# EasyEDA Pro project ProProject_STM32H7_Ver0.2_2023-08-24.epro

# Schematic Schematic1
Create Date: 2023-07-07; Page Name: P1; Project Name: STM32H7_Ver0.2; Schematic Name: Schematic1; Update Date: 2023-07-14; Company: 嘉立创EDA; Page Size: A4; Version: V1.0
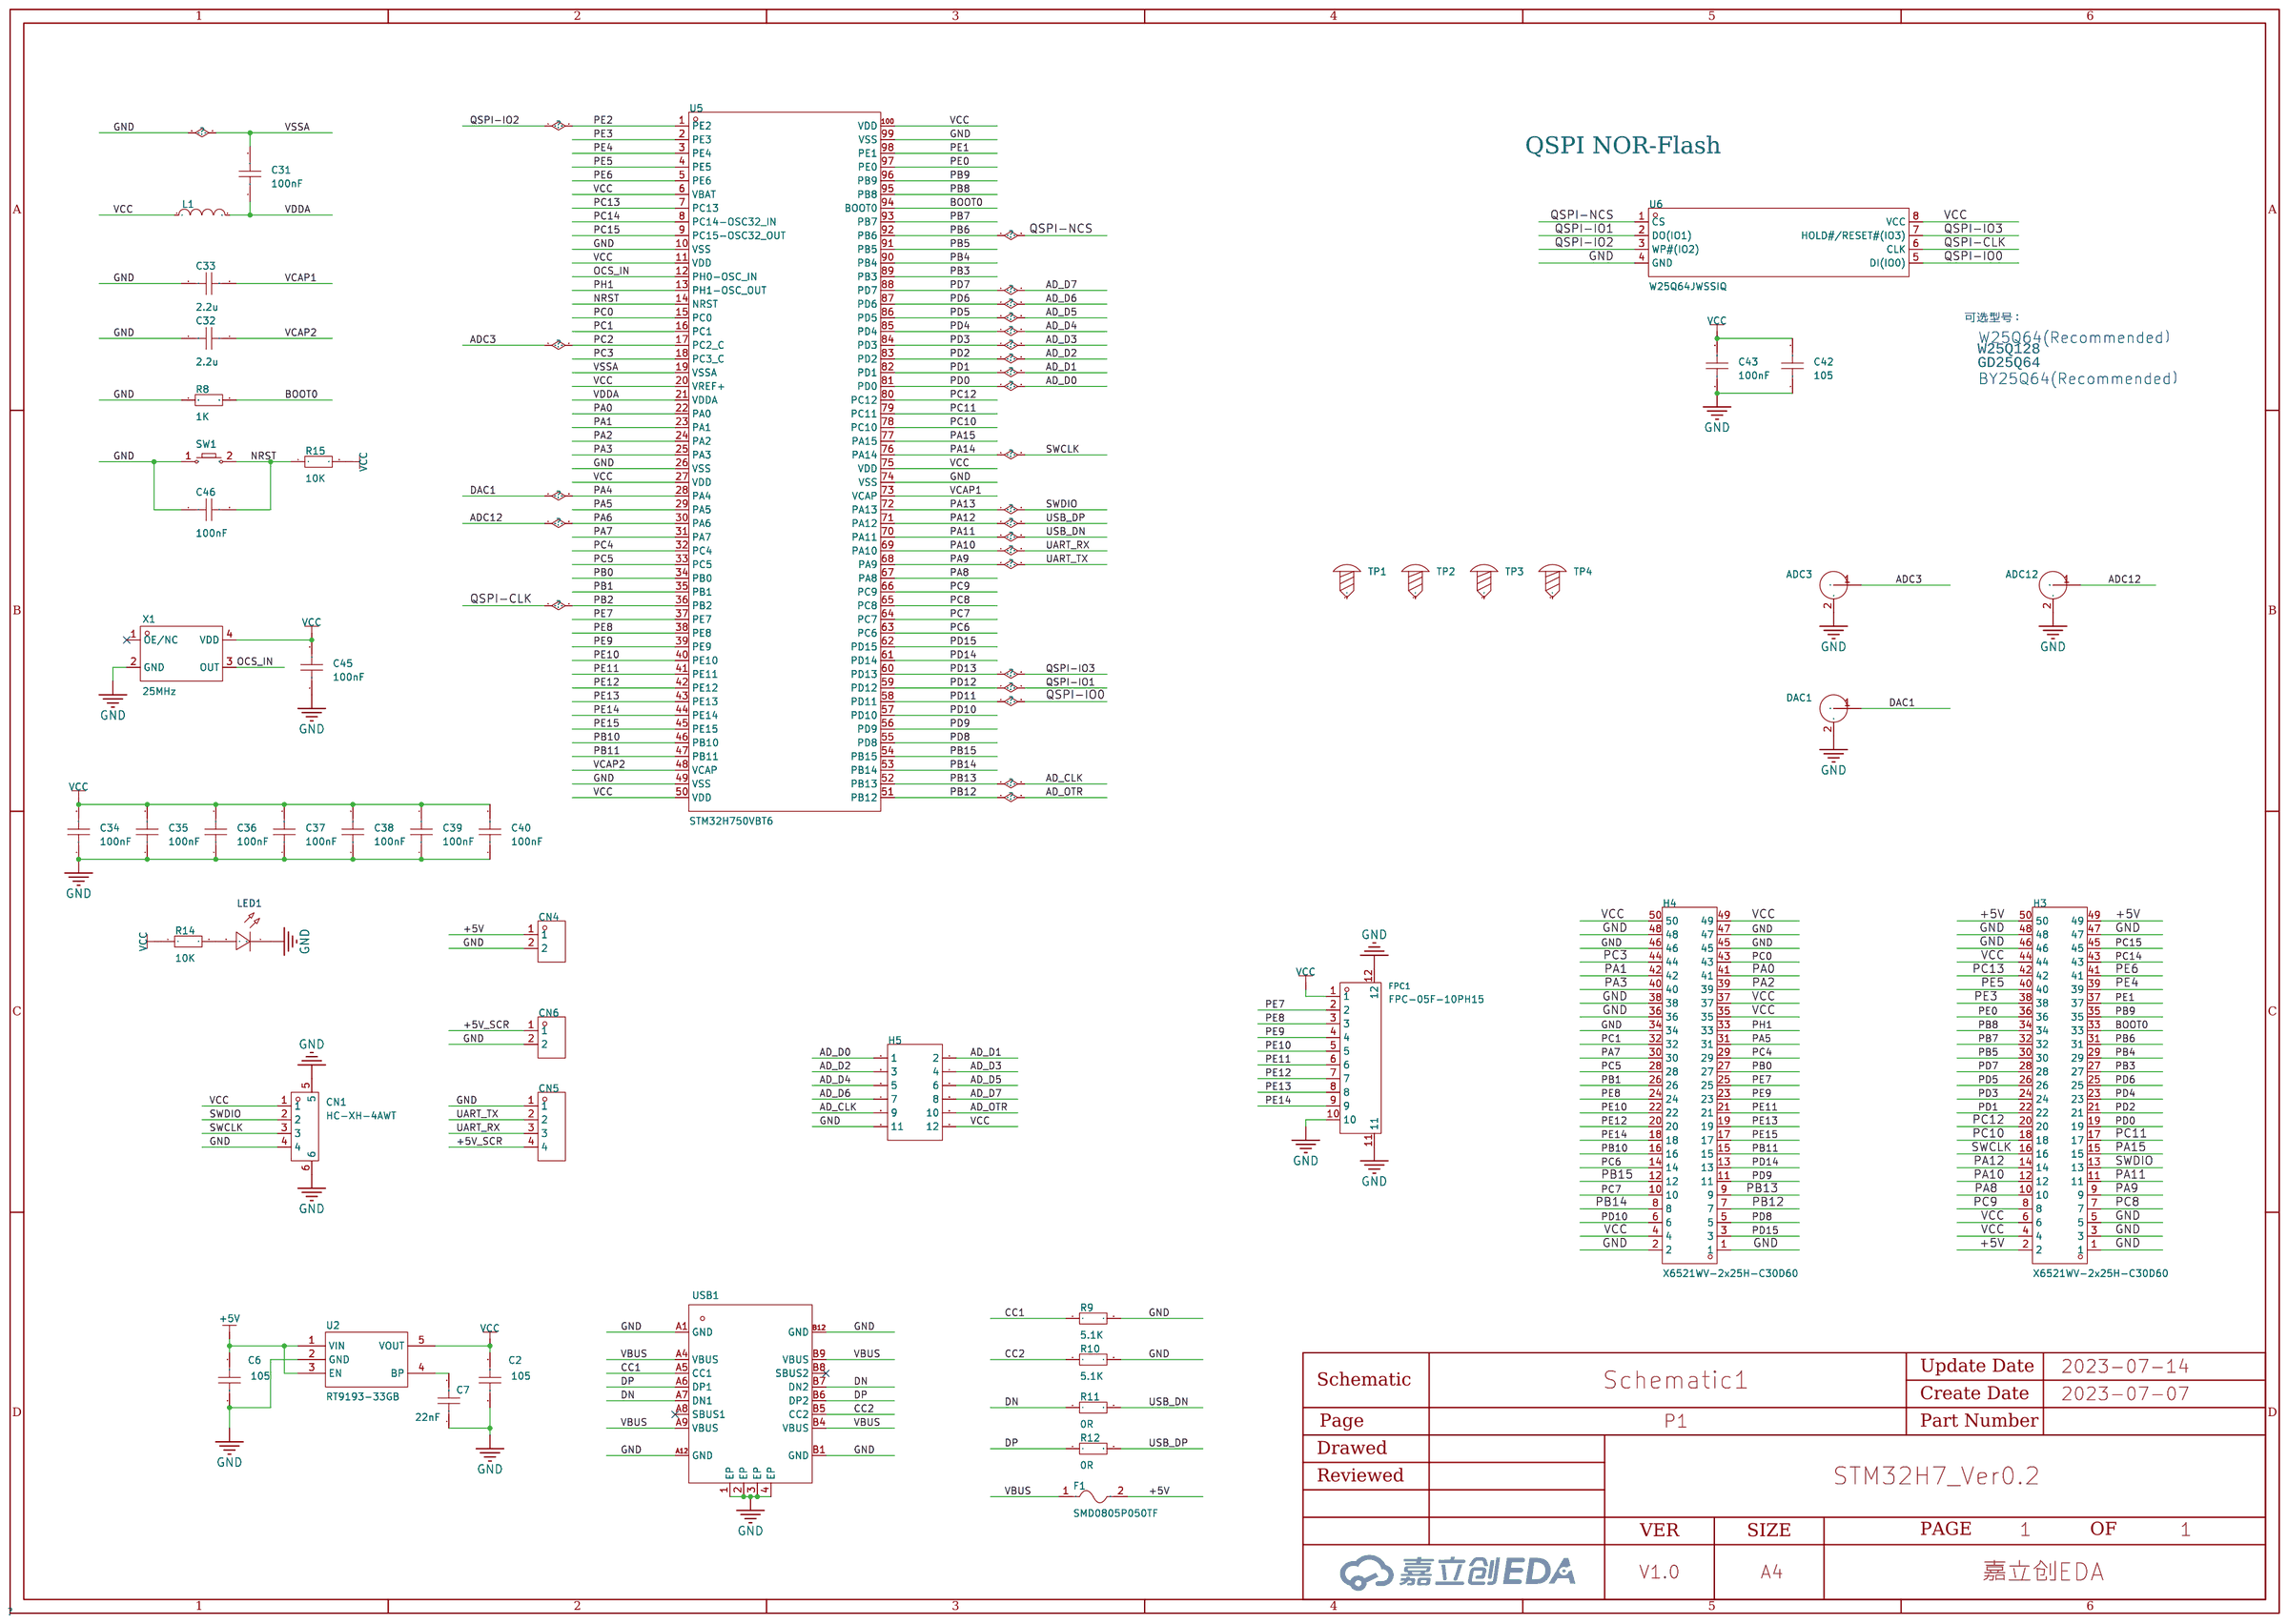
[diagram p0: schematic sheet]

## Parts
ADC3  BWSMA-KWE-Z001  [SMA-TH_BWSMA-KWE-Z001]
ADC12  BWSMA-KWE-Z001  [SMA-TH_BWSMA-KWE-Z001]
C2  100nF  [C0603]
C6  100nF  [C0603]
C7  100nF  [C0603]
C31  100nF  [C0402]
C32  2.2u  [C0603]
C33  2.2u  [C0603]
C34  100nF  [C0402]
C35  100nF  [C0402]
C36  100nF  [C0402]
C37  100nF  [C0402]
C38  100nF  [C0402]
C39  100nF  [C0402]
C40  100nF  [C0402]
C42  105  [C0603]
C43  100nF  [C0603]
C45  100nF  [C0402]
C46  100nF  [C0402]
CN1  HC-XH-4AWT  [CONN-SMD_HC-XH-4AWT]
CN4  HX25003-2A  [CONN-TH_2P-P2.50_HX25003-2A]
CN5  HX25003-4A  [CONN-TH_4P-P2.50_HX25003-4A]
CN6  HX25003-2A  [CONN-TH_2P-P2.50_HX25003-2A]
DAC1  BWSMA-KWE-Z001  [SMA-TH_BWSMA-KWE-Z001]
F1  SMD0805P050TF  [F0805]
FPC1  FPC-05F-10PH15  [FPC-SMD_10P-P0.50_XUNPU_FPC-05F-10PH15]
H3  X6521WV-2x25H-C30D60  [HDR-TH_50P-2.54-V-M-R2-C25-S2.54]
H4  X6521WV-2x25H-C30D60  [HDR-TH_50P-2.54-V-M-R2-C25-S2.54]
H5  -  [HDR-TH_12P-P2.54-V-M-R2-C6-S2.54]
L1  SBH2012S601NSP  [L0805]
LED1  -  [LED_0805]
R8  1K  [R0603]
R9  5.1K  [R0603]
R10  5.1K  [R0603]
R11  0R  [R0603]
R12  0R  [R0603]
R14  10K  [R0603]
R15  10K  [R0603]
SW1  -  [Key_SMD_3x4x2]
TP1  -  [M3螺丝]
TP2  -  [M3螺丝]
TP3  -  [M3螺丝]
TP4  -  [M3螺丝]
U2  RT9193-33GB  [SOT-23-5_L3.0-W1.7-P0.95-LS2.8-BR]
U5  STM32H750VBT6  [LQFP-100_L14.0-W14.0-P0.50-LS16.0-BL]
U6  W25Q64JWSSIQ  [SOIC-8_L5.3-W5.3-P1.27-LS8.0-BL]
USB1  -  [USB_TYPE-C-16P]
X1  25MHz  [OSC-SMD_4P-L3.2-W2.5-BL]

## Library data of the parts
ADC3 ADC12 DAC1 = BWSMA-KWE-Z001: 连接器类型:板端;射频系列:SMA;接口类型:内孔;端口数量:1;阻抗:50Ω;频率-最大值:12.4GHz;样式:弯头;接口直径:5.3mm;接口长度/高度:-;工作温度范围:-;; LCSC Part Name: SMA内孔弯头SMA天线座SMA弯头正脚板端座子; Supplier Part: C496551; Manufacturer: BATWIRELESS(蝙蝠无线); Supplier Footprint: 插件; JLCPCB Part Class: ExtendedPart; Datasheet: https://atta.szlcsc.com/upload/public/pdf/source/20201015/C496551_6AE7B02D24D60B4F78A8937E4C4F8093.pdf; Supplier: LCSC; Connector Type: 板端; RF Series: SMA; Interface Type: 内孔; Number of Ports: 1; Impedance: 50Ω; Frequency-Max: 12.4GHz; Style: 弯头; Interface Diameter: 5.3mm
C2 C6 C7 C32 C33 C42 C43 = CAP_0603: Supplier Footprint: 0603
C31 C34-C40 C45 C46 = CAP_0402: Supplier Footprint: 0402
CN1 = HC-XH-4AWT: 参考系列:-;间距:2.5mm;插针结构:1x4P;排数:1;每排PIN数:4;行距:-;公母:公型插针;安装方式:卧贴;额定电流:3A;工作温度范围:-25℃~+85℃;; LCSC Part Name: 4P卧贴间距P=2.5mm; Supplier Part: C2845685; Manufacturer: HCTL(华灿天禄); Supplier Footprint: SMD,P=2.5mm; JLCPCB Part Class: ExtendedPart; Datasheet: https://atta.szlcsc.com/upload/public/pdf/source/20210728/C2845684_965343274C5A1ED3FF00B3B6BCC0A9E5.pdf; Supplier: LCSC; Pitch: 2.5mm; Pins Structure: 1x4P; Number of Rows: 1; Number of PINs Per Row: 4; Gender: 公型插针; Mounting Style: 卧贴; Current Rating (Max): 3A; Operating Temperature Range: -25℃~+85℃
CN4 CN6 = HX25003-2A: 参考系列:XH;间距:2.5mm;插针结构:1x2P;排数:1;每排PIN数:2;行距:-;公母:公型插针;安装方式:直插;额定电流:-;工作温度范围:-;; LCSC Part Name: XH2.5mm1x2P直插母座; Supplier Part: C442299; Manufacturer: HX(红星); Supplier Footprint: 插件,P=2.5mm; JLCPCB Part Class: ExtendedPart; Datasheet: https://atta.szlcsc.com/upload/public/pdf/source/20191028/C442299_791AF061D32404B3CF2743C2F942DF66.pdf; Supplier: LCSC; Reference Series: XH; Pitch: 2.5mm; Pins Structure: 1x2P; Number of Rows: 1; Number of PINs Per Row: 2; Gender: 公型插针; Mounting Style: 直插
CN5 = HX25003-4A: 参考系列:XH;间距:2.5mm;插针结构:1x4P;排数:1;每排PIN数:4;行距:-;公母:公型插针;安装方式:直插;额定电流:-;工作温度范围:-;; LCSC Part Name: XH2.5mm1x4P直插; Supplier Part: C442301; Manufacturer: HX(红星); Supplier Footprint: 插件,P=2.5mm; JLCPCB Part Class: ExtendedPart; Datasheet: https://atta.szlcsc.com/upload/public/pdf/source/20191028/C442301_3A3D3A554E5F0CBC5D03B496CD495BC6.pdf; Supplier: LCSC; Reference Series: XH; Pitch: 2.5mm; Pins Structure: 1x4P; Number of Rows: 1; Number of PINs Per Row: 4; Gender: 公型插针; Mounting Style: 直插
F1 = SMD0805P050TF_C130286: 最大电压:6V;跳闸电流:1A;; LCSC Part Name: 0.5A6V自恢复保险丝; Supplier Part: C130286; Supplier Footprint: 0805; JLCPCB Part Class: ExtendedPart; Datasheet: https://atta.szlcsc.com/upload/public/pdf/source/20190513/C130286_321817637DA104FC2E38BDC6A20718F4.pdf; Supplier: LCSC
FPC1 = FPC-05F-10PH15: 间距:0.5mm;触点数量:10P;锁定特性:翻盖式;安装类型:卧贴;触点类型:下接;工作温度范围:-25℃~+85℃;; LCSC Part Name: 0.5mm P数:10P 翻盖式 下接; Supplier Part: C2856816; Manufacturer: XUNPU(讯普); Supplier Footprint: SMD,P=0.5mm; JLCPCB Part Class: Extended Part; Datasheet: https://atta.szlcsc.com/upload/public/pdf/source/20210922/C2856816_615E5C188F8387E0CDE660452299C2FD.pdf; Supplier: LCSC; Pitch: 0.5mm; Number of Contacts: 10P; Locking Feature: 翻盖式; Mounting Type: 卧贴; Contact Type: 下接; Height Above Board: 1.5mm; FFC, FCB Thickness: 0.3mm; Operating Temperature Range: -25℃~+85℃
H3 H4 = X6521WV-2x25H-C30D60: 排数:双排;总PIN位数:50;间距:2.54mm;插针结构:2x25P;行距:2.54mm;安装类型:直插;圆针/方针:方针;额定电流:3A;额定电压:250V;配合针长度:6mm;塑高:2.5mm;端接针长度:3mm;触头材质:黄铜;触头镀层:金;工作温度范围:-40℃~+105℃;焊接温度(最大值):260℃;颜色:黑色;; LCSC Part Name: 2.54mm2x25P直插方针; Supplier Part: C725897; Manufacturer: XKBConnectivity(中国星坤); Supplier Footprint: 插件,P=2.54mm; JLCPCB Part Class: ExtendedPart; Datasheet: https://atta.szlcsc.com/upload/public/pdf/source/20211009/DE33EBA4104B5B447A7BD8383FBBA145.pdf; Supplier: LCSC; Number of Rows: 双排; Number of Pins: 50; Pitch: 2.54mm; Pin Structure: 2x25P; Row Spacing: 2.54mm; Mounting Type: 直插; Circluar Pins/Square Pins: 方针; Current Rating (Max): 3A; Voltage Rating (Max): 250V; Length of Mating Pin: 6mm; Insulation Height: 2.5mm; Length of End Connection Pin: 3mm; Contact Material: 黄铜; Contact Plating: 金; Operating Temperature Range: -40℃~+105℃; Welding Temperature (Max): 260℃; Color: 黑色
H5 = HDR-F_2.54_2x6: Supplier Part: C92270; Supplier Footprint: 插件
L1 = SBH2012S601NSP: 标称阻抗@测试频率:600Ω@100MHz;误差:±25%;直流电阻(RDC):90mΩ;额定电流:2A;电路数:1;; LCSC Part Name: 600Ω@100MHz±25%; Supplier Part: f; Manufacturer: Sunltech(韩国顺磁); Supplier Footprint: SMD; JLCPCB Part Class: ExtendedPart; Datasheet: https://atta.szlcsc.com/upload/public/pdf/source/20180502/C216152_A4DD12EF526EA5B19012580C3D24E2AB.pdf; Supplier: LCSC; Impedance @ Frequency: 600Ω@100MHz; Tolerance: ±25%; DC Resistance: 90mΩ; Current Rating: 2A; Circuits: 1
LED1 = LED_0805-G: Supplier Footprint: 0805
R8-R12 R14 R15 = Res_0603: Supplier Footprint: 0603
SW1 = Key_SMD_3x4x2: Supplier Footprint: SMD
TP1-TP4 = M3螺丝: Supplier Footprint: 插件
U2 = RT9193-18GB: 输出类型:固定;输出极性:正;输出通道数:1;最大输入电压:5.5V;输出电压:1.8V~1.8V;压差:-;输出电流:300mA;电源纹波抑制比(PRSS):70dB@(100Hz),50dB@(10kHz);; LCSC Part Name: Vin=5.5VVout=1.8V~1.8V300mA70dB@(100Hz),50dB@(10kHz); Supplier Part: C27416; Manufacturer: RICHTEK(台湾立锜); Supplier Footprint: SOT-23-5; JLCPCB Part Class: ExtendedPart; Datasheet: https://atta.szlcsc.com/upload/public/pdf/source/20140319/1457707024880.pdf; Supplier: LCSC; Output Type: 固定; Output Polarity: 正; Number of Outputs: 1; Maximum Input Voltage: 5.5V; Output Voltage: 1.8V~1.8V; Output Current: 300mA; Power Supply Rejection Ratio (PRSS): 70dB@(100Hz),50dB@(10kHz)
U5 = STM32H750VBT6: CPU内核:ARM-M系列;CPU最大主频:480MHz;程序存储容量:128KB;程序存储器类型:FLASH;RAM总容量:1MB;GPIO端口数量:82;; LCSC Part Name: ARM-M系列480MHz; Supplier Part: C404010; Manufacturer: ST(意法半导体); Supplier Footprint: LQFP-100(14x14); JLCPCB Part Class: ExtendedPart; Datasheet: https://atta.szlcsc.com/upload/public/pdf/source/20190722/C404010_6028FDD7E25CA1D71DA8F4066CF0EFF7.pdf; Supplier: LCSC; CPU Core: ARM-M系列; CPU Maximum Speed: 480MHz; Operating Voltage Range: 1.62V~3.6V; Program Storage Size: 128KB; Program Memory Type: FLASH; RAM Size: 1MB; EEPROM: 128KB; GPIO Ports Number: 82; ADC (Bit): 16bit; DAC (Bit): 12bit; Universal Serial Bus: 有; Peripheral/Function: DMA；LCD/LED驱动; Watchdog: 有; Infrared Data Association: 有; Low-Voltage Detect: 有; LCD Module: 有; Secure Digital Input and Output: 有; Direct Memory Access: 有; Internal Oscillator: 有; Operating Temperature Range: -40℃~+85℃
U6 = W25Q64JWSSIQ_C2895586: Supplier Part: C2895586; Manufacturer: WINBOND(华邦); Supplier Footprint: SOIC-8-208mil; JLCPCB Part Class: ExtendedPart; Datasheet: https://atta.szlcsc.com/upload/public/pdf/source/20210420/C2595075_E7A7725B7CF2DE50C07916BF10CAF3A1.pdf; Supplier: LCSC
USB1 = USB_TYPE-C-16P: Supplier Footprint: SMD
X1 = CO32H4-25.000-33JDTSN: 频率:25MHz;频率稳定度:±30ppm;工作电压:3.3V;输出模式:HCMOS;工作温度:-40~+85;; LCSC Part Name: 25MHz±30ppm3.3VHCMOS; Supplier Part: C2925590; Manufacturer: HCI(杭晶); Supplier Footprint: SMD3225-4P; JLCPCB Part Class: ExtendedPart; Datasheet: https://atta.szlcsc.com/upload/public/pdf/source/20220525/B926948FC129C170F991EA6FAC6092C6.pdf; Supplier: LCSC; Frequency Stability: ±30ppm; Supply Voltage: 3.3V; Output Type: HCMOS; Operating Temperature: -40~+85

## Nets
+5V: C6.2 CN4.1 F1.2 H3.2 H3.49 H3.50 U2.1(VIN) U2.3(EN)
+5V_SCR: CN5.4 CN6.1
GND: ADC3.2 ADC12.2 C2.1 C6.1 C7.1 C31.2 C32.2 C33.2 C34.1 C35.1 C36.1 C37.1 C38.1 C39.1 C40.1 C42.1 C43.1 C45.1 C46.1 CN1.4 CN1.5 CN1.6 CN4.2 CN5.1 CN6.2 DAC1.2 FPC1.10 FPC1.11 FPC1.12 H3.1 H3.3 H3.5 H3.46 H3.47 H3.48 H4.1 H4.2 H4.34 H4.36 H4.38 H4.45 H4.46 H4.47 H4.48 H5.11 LED1.1(C) R8.1 R9.2 R10.2 SW1.1 U2.2(GND) U5.10(VSS) U5.19(VSSA) U5.26(VSS) U5.49(VSS) U5.74(VSS) U5.99(VSS) U6.4(GND) USB1.1(EP) USB1.2(EP) USB1.3(EP) USB1.4(EP) USB1.A1(GND) USB1.A12(GND) USB1.B1(GND) USB1.B12(GND) X1.2(GND)
VBUS: F1.1 USB1.A4(VBUS) USB1.A9(VBUS) USB1.B4(VBUS) USB1.B9(VBUS)
VCC: C2.2 C34.2 C35.2 C36.2 C37.2 C38.2 C39.2 C40.2 C42.2 C43.2 C45.2 CN1.1 FPC1.1 H3.4 H3.6 H3.44 H4.4 H4.35 H4.37 H4.49 H4.50 H5.12 L1.1 R14.1 R15.2 U2.5(VOUT) U5.6(VBAT) U5.11(VDD) U5.20(VREF+) U5.27(VDD) U5.50(VDD) U5.75(VDD) U5.100(VDD) U6.8(VCC) X1.4(VDD)
VDDA: C31.1 L1.2 U5.21(VDDA)
AD_CLK: H4.9 H5.9 U5.52(PB13)
AD_D0: H3.19 H5.1 U5.81(PD0)
AD_D1: H3.22 H5.2 U5.82(PD1)
AD_D2: H3.21 H5.3 U5.83(PD2)
AD_D3: H3.24 H5.4 U5.84(PD3)
AD_D4: H3.23 H5.5 U5.85(PD4)
AD_D5: H3.26 H5.6 U5.86(PD5)
AD_D6: H3.25 H5.7 U5.87(PD6)
AD_D7: H3.28 H5.8 U5.88(PD7)
AD_OTR: H4.7 H5.10 U5.51(PB12)
ADC3: ADC3.1 U5.17(PC2_C)
ADC12: ADC12.1 U5.30(PA6)
BOOT0: H3.33 R8.2 U5.94(BOOT0)
CC1: R9.1 USB1.A5(CC1)
CC2: R10.1 USB1.B5(CC2)
DAC1: DAC1.1 U5.28(PA4)
DN: R11.1 USB1.A7(DN1) USB1.B7(DN2)
DP: R12.1 USB1.A6(DP1) USB1.B6(DP2)
NRST: C46.2 R15.1 SW1.2 U5.14(NRST)
OCS_IN: U5.12(PH0-OSC_IN) X1.3(OUT)
PA0: H4.41 U5.22(PA0)
PA1: H4.42 U5.23(PA1)
PA2: H4.39 U5.24(PA2)
PA3: H4.40 U5.25(PA3)
PA5: H4.31 U5.29(PA5)
PA7: H4.30 U5.31(PA7)
PA8: H3.10 U5.67(PA8)
PA9: CN5.2 H3.9 U5.68(PA9)
PA10: CN5.3 H3.12 U5.69(PA10)
PA11: H3.11 R11.2 U5.70(PA11)
PA12: H3.14 R12.2 U5.71(PA12)
PA13: CN1.2 H3.13 U5.72(PA13)
PA14: CN1.3 H3.16 U5.76(PA14)
PA15: H3.15 U5.77(PA15)
PB0: H4.27 U5.34(PB0)
PB1: H4.26 U5.35(PB1)
PB2: U5.36(PB2) U6.6(CLK)
PB3: H3.27 U5.89(PB3)
PB4: H3.29 U5.90(PB4)
PB5: H3.30 U5.91(PB5)
PB6: H3.31 U5.92(PB6) U6.1(CS)
PB7: H3.32 U5.93(PB7)
PB8: H3.34 U5.95(PB8)
PB9: H3.35 U5.96(PB9)
PB10: H4.16 U5.46(PB10)
PB11: H4.15 U5.47(PB11)
PB14: H4.8 U5.53(PB14)
PB15: H4.12 U5.54(PB15)
PC0: H4.43 U5.15(PC0)
PC1: H4.32 U5.16(PC1)
PC3: H4.44 U5.18(PC3_C)
PC4: H4.29 U5.32(PC4)
PC5: H4.28 U5.33(PC5)
PC6: H4.14 U5.63(PC6)
PC7: H4.10 U5.64(PC7)
PC8: H3.7 U5.65(PC8)
PC9: H3.8 U5.66(PC9)
PC10: H3.18 U5.78(PC10)
PC11: H3.17 U5.79(PC11)
PC12: H3.20 U5.80(PC12)
PC13: H3.42 U5.7(PC13)
PC14: H3.43 U5.8(PC14-OSC32_IN)
PC15: H3.45 U5.9(PC15-OSC32_OUT)
PD8: H4.5 U5.55(PD8)
PD9: H4.11 U5.56(PD9)
PD10: H4.6 U5.57(PD10)
PD11: U5.58(PD11) U6.5(DI(IO0))
PD12: U5.59(PD12) U6.2(DO(IO1))
PD13: U5.60(PD13) U6.7(HOLD#/RESET#(IO3))
PD14: H4.13 U5.61(PD14)
PD15: H4.3 U5.62(PD15)
PE0: H3.36 U5.97(PE0)
PE1: H3.37 U5.98(PE1)
PE2: U5.1(PE2) U6.3(WP#(IO2))
PE3: H3.38 U5.2(PE3)
PE4: H3.39 U5.3(PE4)
PE5: H3.40 U5.4(PE5)
PE6: H3.41 U5.5(PE6)
PE7: FPC1.2 H4.25 U5.37(PE7)
PE8: FPC1.3 H4.24 U5.38(PE8)
PE9: FPC1.4 H4.23 U5.39(PE9)
PE10: FPC1.5 H4.22 U5.40(PE10)
PE11: FPC1.6 H4.21 U5.41(PE11)
PE12: FPC1.7 H4.20 U5.42(PE12)
PE13: FPC1.8 H4.19 U5.43(PE13)
PE14: FPC1.9 H4.18 U5.44(PE14)
PE15: H4.17 U5.45(PE15)
PH1: H4.33 U5.13(PH1-OSC_OUT)
VCAP1: C33.1 U5.73(VCAP)
VCAP2: C32.1 U5.48(VCAP)
$1N6362: C7.2 U2.4(BP)
$1N9146: LED1.2(A) R14.2

Not connected (* = marked no-connect by the designer): TP1 1; TP2 1; TP3 1; TP4 1; USB1 A8(SBUS1)* B8(SBUS2)*; X1 1(OE/NC)*

## Notes on the sheet
- QSPI NOR-Flash
- 可选型号：
- W25Q64(Recommended）
- GD25Q64
- W25Q128
- BY25Q64(Recommended）

# Board PCB1
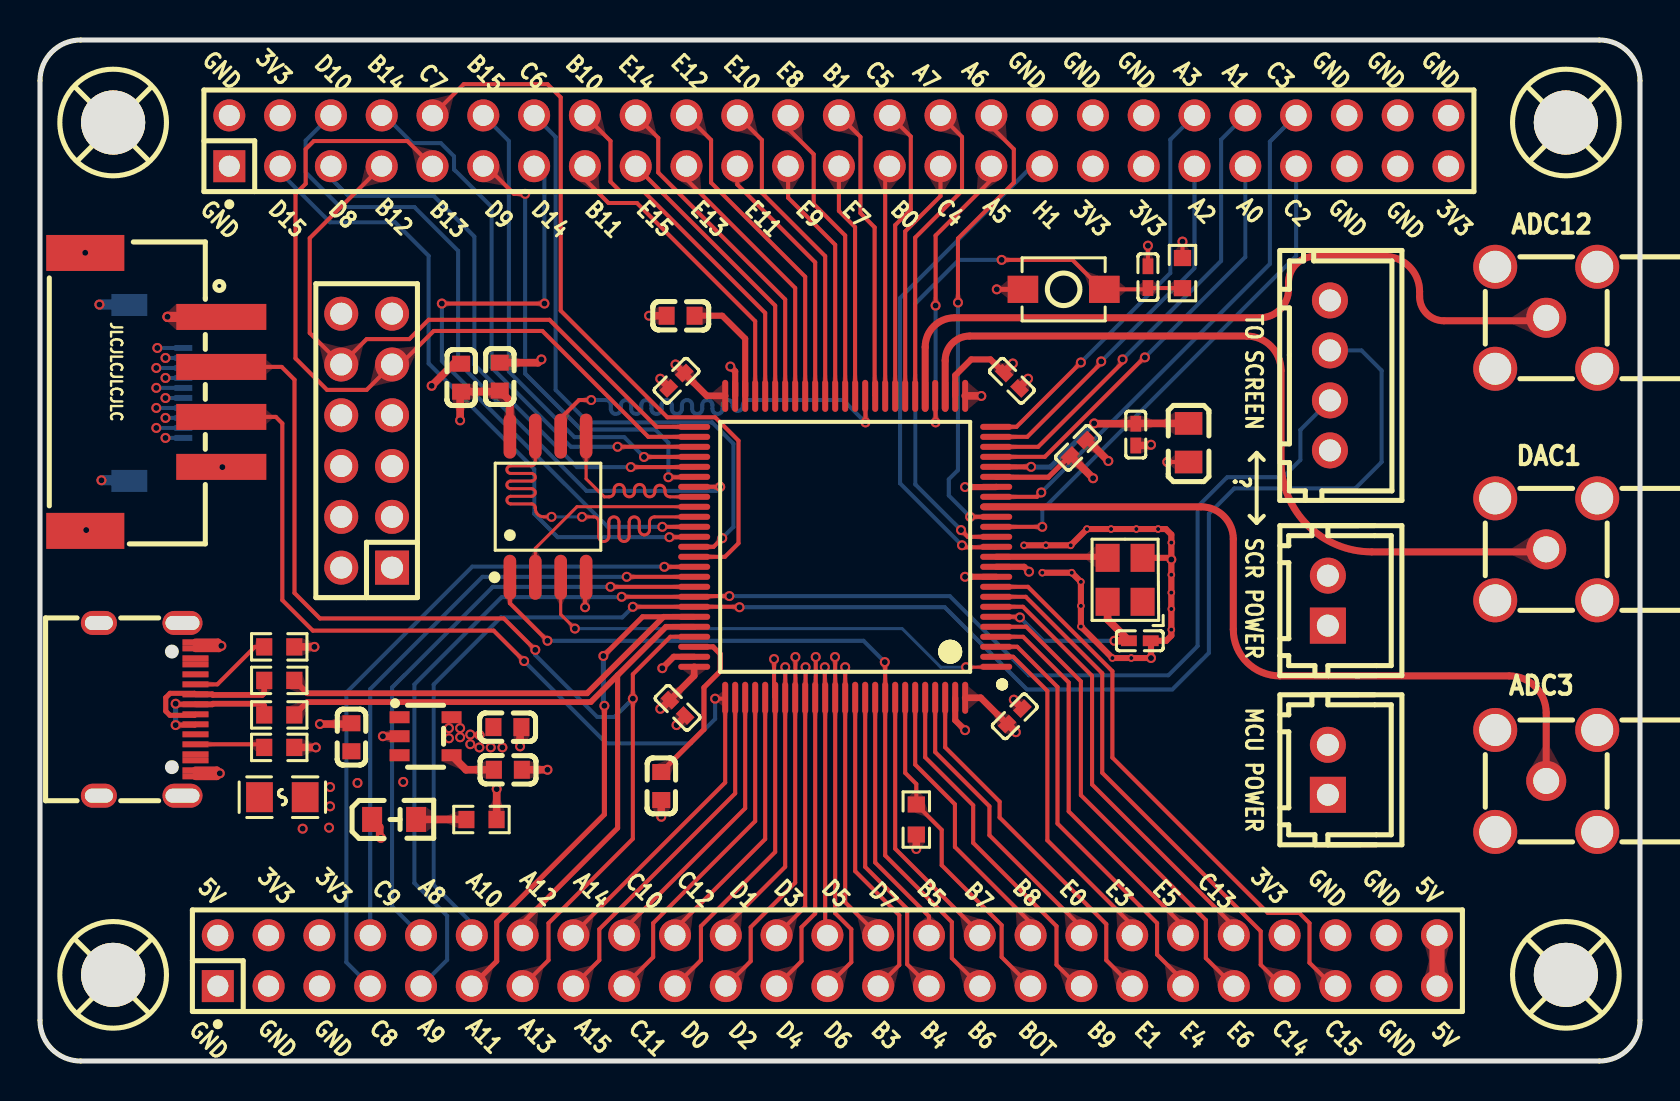
[diagram p1: board, top side]
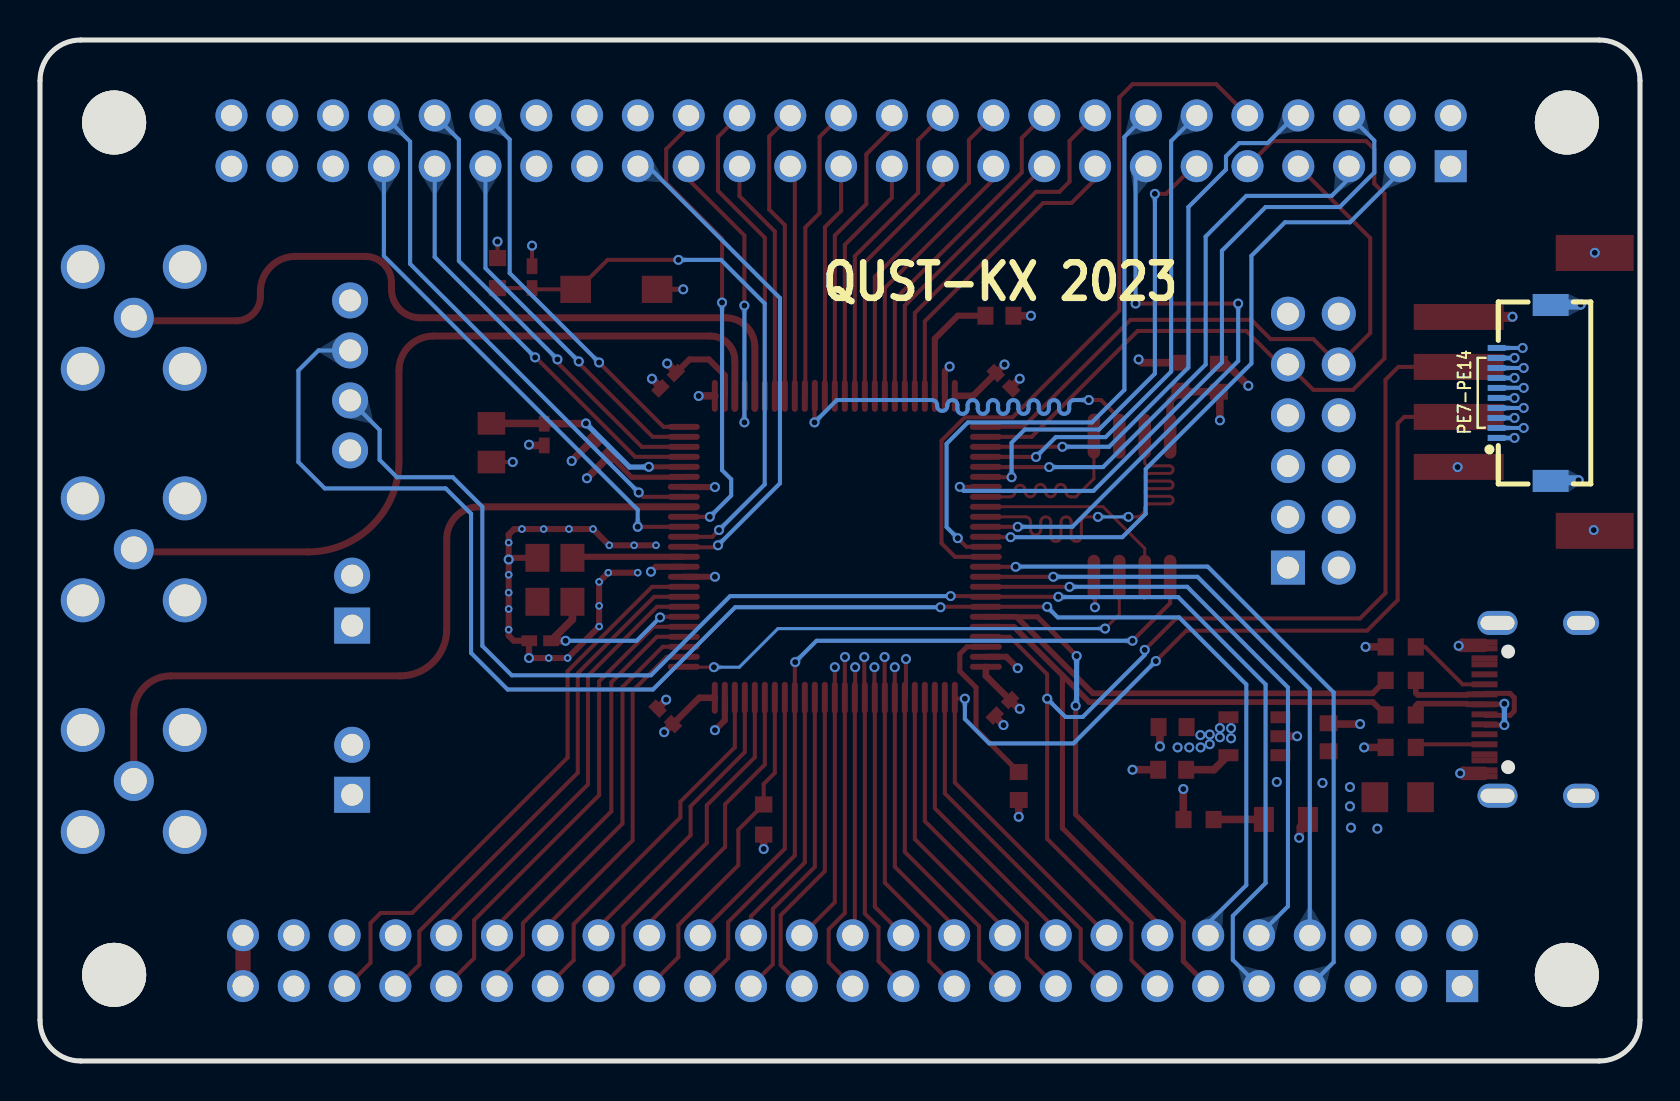
[diagram p2: board, bottom side, seen from below]

Outline 80 x 51.07 mm; copper layers: Top Layer, Inner1, Inner2, Bottom Layer. Coordinates in mm from the lower left corner of the outline.
Outline path: 0,49.03 0,2.03 arc(0.6,0.6) 2.03,0 77.97,0 arc(79.4,0.6) 80,2.03 80,49.03 arc(79.4,50.47) 77.97,51.07 2.03,51.07 arc(0.6,50.47) 0,49.03
Stack: Top Layer 0.035mm / Dielectric1 0.48mm PP er 4.5 / Inner1 0.035mm / Dielectric2 0.48mm FR4 er 4.5 / Inner2 0.035mm / Dielectric3 0.48mm PP er 4.5 / Bottom Layer 0.035mm

## Design rules (mm)
net PA12: DP2
net PA11: DP2
net DN: DP1
net DP: DP1
template: 自定义配置
spacing copperThickness1oz (default): track to track 0.102, other pairs 0.152 to 0.3
spacing copperThickness2oz: track to track 0.203, other pairs 0.152 to 0.3
track width copperThickness1oz (default): min 0.127, default 0.203, max 2.54
track width copperThickness2oz: min 0.203, default 0.254, max 2.54
differential pair differentialPair (default): width min 0.127, default 0.254, max 2.54; gap min 0.152, default 0.152
via viaSize (default): diameter min 0, default 0.381, max 10; hole min 0, default 0.203, max 6.299

## Placement (name value [footprint] x y rotation side)
ADC3  BWSMA-KWE-Z001  [SMA-TH_BWSMA-KWE-Z001]  75.31 14.01 0 top
ADC12  BWSMA-KWE-Z001  [SMA-TH_BWSMA-KWE-Z001]  75.31 37.17 0 top
C2  100nF  [C0603]  23.37 16.7 180 top
C6  100nF  [C0603]  15.57 16.19 270 top
C7  100nF  [C0603]  23.39 14.57 180 top
C31  100nF  [C0402]  54.79 31.33 270 top
C32  2.2u  [C0603]  32.03 37.27 180 top
C33  2.2u  [C0603]  31.06 13.75 270 top
C34  100nF  [C0402]  51.89 30.67 225 top
C37  100nF  [C0402]  31.83 34.02 45 top
C38  100nF  [C0402]  48.74 17.24 225 top
C39  100nF  [C0402]  31.88 17.67 135 top
C40  100nF  [C0402]  48.59 34.02 135 top
C42  105  [C0603]  22.99 34.23 270 top
C43  100nF  [C0603]  21.06 34.18 270 top
C45  100nF  [C0402]  54.99 21.02 180 top
C46  100nF  [C0402]  55.4 39.21 270 top
CN1  HC-XH-4AWT  [CONN-SMD_HC-XH-4AWT]  5.66 33.46 270 top
CN4  HX25003-2A  [CONN-TH_2P-P2.50_HX25003-2A]  64.39 14.57 90 top
CN5  HX25003-4A  [CONN-TH_4P-P2.50_HX25003-4A]  64.5 34.29 90 top
CN6  HX25003-2A  [CONN-TH_2P-P2.50_HX25003-2A]  64.39 23.03 90 top
DAC1  BWSMA-KWE-Z001  [SMA-TH_BWSMA-KWE-Z001]  75.31 25.59 0 top
F1  SMD0805P050TF  [F0805]  12.12 13.2 0 top
FPC1  FPC-05F-10PH15  [FPC-SMD_10P-P0.50_XUNPU_FPC-05F-10PH15]  5.82 33.41 90 bottom
H3  X6521WV-2x25H-C30D60  [HDR-TH_50P-2.54-V-M-R2-C25-S2.54]  39.37 5.02 0 top
H4  X6521WV-2x25H-C30D60  [HDR-TH_50P-2.54-V-M-R2-C25-S2.54]  39.95 46.02 0 top
H5  -  [HDR-TH_12P-P2.54-V-M-R2-C6-S2.54]  16.33 31.03 90 top
L1  SBH2012S601NSP  [L0805]  57.43 30.92 90 top
LED1  -  [LED_0805]  17.75 12.08 0 top
R8  1K  [R0603]  43.82 12.08 90 top
R9  5.1K  [R0603]  11.96 20.71 0 top
R10  5.1K  [R0603]  11.96 15.68 0 top
R11  0R  [R0603]  11.96 19.04 0 top
R12  0R  [R0603]  11.96 17.31 0 top
R14  10K  [R0603]  22.07 12.08 180 top
R15  10K  [R0603]  57.12 39.41 90 top
SW1  -  [Key_SMD_3x4x2]  51.18 38.6 0 top
TP1  -  [M3螺丝]  3.72 4.25 0 top
TP2  -  [M3螺丝]  3.72 46.88 0 top
TP3  -  [M3螺丝]  76.36 46.88 0 top
TP4  -  [M3螺丝]  76.36 4.25 0 top
U2  RT9193-33GB  [SOT-23-5_L3.0-W1.7-P0.95-LS2.8-BR]  19.28 16.24 180 top
U5  STM32H750VBT6  [LQFP-100_L14.0-W14.0-P0.50-LS16.0-BL]  40.26 25.72 90 top
U6  W25Q64JWSSIQ  [SOIC-8_L5.3-W5.3-P1.27-LS8.0-BL]  25.4 27.72 0 top
USB1  -  [USB_TYPE-C-16P]  5.36 17.72 270 top
X1  25MHz  [OSC-SMD_4P-L3.2-W2.5-BL]  54.25 24.07 90 top

## Footprints (pads in the part's own frame, mm; a bottom-side part is the same pattern mirrored in y, then rotated)
C0402
  rect 0.79x0.54 smd: 1(-0.545,0) 2(0.545,0)
C0603
  rect 0.8x0.9 smd: 1(-0.7,0) 2(0.7,0)
CONN-SMD_HC-XH-4AWT
  rect 1.3x4.5 smd: 1(-3.75,3.4) 2(-1.25,3.4) 3(1.25,3.4) 4(3.75,3.4)
  rect 1.8x3.9 smd: 5(-6.95,-3.4) 6(6.95,-3.4)
CONN-TH_2P-P2.50_HX25003-2A
  rect 1.8x1.8 hole 1.1: 1(-1.25,0)
  round 1.8 hole 1.1: 2(1.25,0)
CONN-TH_4P-P2.50_HX25003-4A
  round 1.8 hole 1.1: 1(-3.75,0) 2(-1.25,0) 3(1.25,0) 4(3.75,0)
F0805
  rect 1.335x1.5 smd: 1(-1.143,0) 2(1.143,0)
FPC-SMD_10P-P0.50_XUNPU_FPC-05F-10PH15
  rect 0.3x0.9 smd: 1(-2.25,1.35) 2(-1.75,1.35) 3(-1.25,1.35) 4(-0.75,1.35) 5(-0.25,1.35) 6(0.25,1.35) 7(0.75,1.35) 8(1.25,1.35) 9(1.75,1.35) 10(2.25,1.35)
  rect 1.1x1.8 smd: 11(4.4,-1.35) 12(-4.4,-1.35)
HDR-TH_12P-P2.54-V-M-R2-C6-S2.54
  rect 1.7x1.7 hole 1.1: 1(-6.35,-1.27)
  round 1.7 hole 1.1: 2(-6.35,1.27) 3(-3.81,-1.27) 4(-3.81,1.27) 5(-1.27,-1.27) 6(-1.27,1.27) 7(1.27,-1.27) 8(1.27,1.27) 9(3.81,-1.27) 10(3.81,1.27) 11(6.35,-1.27) 12(6.35,1.27)
HDR-TH_50P-2.54-V-M-R2-C25-S2.54
  rect 1.6x1.6 hole 1.05: 1(-30.48,-1.27)
  round 1.6 hole 1.05: 2(-30.48,1.27) 3(-27.94,-1.27) 4(-27.94,1.27) 5(-25.4,-1.27) 6(-25.4,1.27) 7(-22.86,-1.27) 8(-22.86,1.27) 9(-20.32,-1.27) 10(-20.32,1.27) 11(-17.78,-1.27) 12(-17.78,1.27) 13(-15.24,-1.27) 14(-15.24,1.27) 15(-12.7,-1.27) 16(-12.7,1.27) 17(-10.16,-1.27) 18(-10.16,1.27) 19(-7.62,-1.27) 20(-7.62,1.27) 21(-5.08,-1.27) 22(-5.08,1.27) 23(-2.54,-1.27) 24(-2.54,1.27) 25(0,-1.27) 26(0,1.27) 27(2.54,-1.27) 28(2.54,1.27) 29(5.08,-1.27) 30(5.08,1.27) 31(7.62,-1.27) 32(7.62,1.27) 33(10.16,-1.27) 34(10.16,1.27) 35(12.7,-1.27) 36(12.7,1.27) 37(15.24,-1.27) 38(15.24,1.27) 39(17.78,-1.27) 40(17.78,1.27) 41(20.32,-1.27) 42(20.32,1.27) 43(22.86,-1.27) 44(22.86,1.27) 45(25.4,-1.27) 46(25.4,1.27) 47(27.94,-1.27) 48(27.94,1.27) 49(30.48,-1.27) 50(30.48,1.27)
Key_SMD_3x4x2
  rect 1.53x1.36 smd: 1(-2.035,0) 2(2.035,0)
L0805
  rect 1.133x1.377 smd: 1(-0.966,0) 2(0.966,0)
LED_0805
  rect 1x1.25 smd: 1(-1.15,0.005) 2(1.05,0.005)
LQFP-100_L14.0-W14.0-P0.50-LS16.0-BL
  oval 0.3x1.6 smd: 1(-6,-7.55) 2(-5.5,-7.55) 3(-5,-7.55) 4(-4.5,-7.55) 5(-4,-7.55) 6(-3.5,-7.55) 7(-3,-7.55) 8(-2.5,-7.55) 9(-2,-7.55) 10(-1.5,-7.55) 11(-1,-7.55) 12(-0.5,-7.55) 13(0,-7.55) 14(0.5,-7.55) 15(1,-7.55) 16(1.5,-7.55) 17(2,-7.55) 18(2.5,-7.55) 19(3,-7.55) 20(3.5,-7.55) 21(4,-7.55) 22(4.5,-7.55) 23(5,-7.55) 24(5.5,-7.55) 25(6,-7.55) 51(6,7.55) 52(5.5,7.55) 53(5,7.55) 54(4.5,7.55) 55(4,7.55) 56(3.5,7.55) 57(3,7.55) 58(2.5,7.55) 59(2,7.55) 60(1.5,7.55) 61(1,7.55) 62(0.5,7.55) 63(0,7.55) 64(-0.5,7.55) 65(-1,7.55) 66(-1.5,7.55) 67(-2,7.55) 68(-2.5,7.55) 69(-3,7.55) 70(-3.5,7.55) 71(-4,7.55) 72(-4.5,7.55) 73(-5,7.55) 74(-5.5,7.55) 75(-6,7.55)
  oval 1.6x0.3 smd: 26(7.55,-6) 27(7.55,-5.5) 28(7.55,-5) 29(7.55,-4.5) 30(7.55,-4) 31(7.55,-3.5) 32(7.55,-3) 33(7.55,-2.5) 34(7.55,-2) 35(7.55,-1.5) 36(7.55,-1) 37(7.55,-0.5) 38(7.55,0) 39(7.55,0.5) 40(7.55,1) 41(7.55,1.5) 42(7.55,2) 43(7.55,2.5) 44(7.55,3) 45(7.55,3.5) 46(7.55,4) 47(7.55,4.5) 48(7.55,5) 49(7.55,5.5) 50(7.55,6) 76(-7.55,6) 77(-7.55,5.5) 78(-7.55,5) 79(-7.55,4.5) 80(-7.55,4) 81(-7.55,3.5) 82(-7.55,3) 83(-7.55,2.5) 84(-7.55,2) 85(-7.55,1.5) 86(-7.55,1) 87(-7.55,0.5) 88(-7.55,0) 89(-7.55,-0.5) 90(-7.55,-1) 91(-7.55,-1.5) 92(-7.55,-2) 93(-7.55,-2.5) 94(-7.55,-3) 95(-7.55,-3.5) 96(-7.55,-4) 97(-7.55,-4.5) 98(-7.55,-5) 99(-7.55,-5.5) 100(-7.55,-6)
M3螺丝
  round 3.2 hole 3.2: 1(-0.064,0.064)
OSC-SMD_4P-L3.2-W2.5-BL
  rect 1.4x1.2 smd: 1(-1.1,-0.875) 2(1.1,-0.875) 3(1.1,0.875) 4(-1.1,0.875)
R0603
  rect 0.806x0.864 smd: 1(-0.753,0) 2(0.753,0)
SMA-TH_BWSMA-KWE-Z001
  round 2 hole 1.3: 1(0,0)
  round 2.2 hole 1.6: 2(-2.55,2.55) 2(-2.55,-2.55) 2(2.55,2.55) 2(2.55,-2.55)
SOIC-8_L5.3-W5.3-P1.27-LS8.0-BL
  oval 0.63x2.25 smd: 1(-1.905,-3.53) 2(-0.635,-3.53) 3(0.635,-3.53) 4(1.905,-3.53) 5(1.905,3.53) 6(0.635,3.53) 7(-0.635,3.53) 8(-1.905,3.53)
SOT-23-5_L3.0-W1.7-P0.95-LS2.8-BR
  rect 1x0.6 smd: 1(1.3,-0.95) 2(1.3,0) 3(1.3,0.95) 4(-1.3,0.95) 5(-1.3,-0.95)
USB_TYPE-C-16P
  oval 1.2x2 hole 0.7x1.7: 1(-4.193,1.765) 2(4.447,1.765)
  oval 1.2x1.8 hole 0.7x1.4: 3(-4.193,-2.415) 4(4.447,-2.415)
  rect 0.3x1.3 smd: A1(-3.223,2.415) A4(-2.423,2.415) A5(-1.123,2.415) A6(-0.123,2.415) A7(0.377,2.415) A8(1.377,2.415) A9(2.677,2.415) A12(3.477,2.415) B1(3.177,2.415) B4(2.377,2.415) B5(1.877,2.415) B6(0.877,2.415) B7(-0.623,2.415) B8(-1.623,2.415) B9(-2.123,2.415) B12(-2.923,2.415)

## Nets
As in the schematic.

Pads without a net: TP1 1; TP2 1; TP3 1; TP4 1; USB1 A8 B8; X1 1

## Via types
v1: diameter 0.381, hole 0.203, Top Layer to Bottom Layer, 19 vias
v2: diameter 0.5, hole 0.3, Top Layer to Bottom Layer, 132 vias

## Routing (per net, layer and track width the routed paths; a pad name or vN(x,y) marks a point on that pad's centre or on a via; arc(x,y) is an arc through that point)
+5V: length 2.5
  Top Layer w0.762: H3.49 H3.50
  vias: v2(13.13,11.62) v2(14.5,13.7) v2(14.5,12.74) v2(14.45,11.67) v2(15.88,13.91) v2(18.16,13.96)
+5V_SCR: length 20.8
  Inner2 w0.889: 64.65,38.05 64.76,37.94 66.38,37.94 67.4,36.93 67.4,23.04 66.15,21.79 64.21,21.79
GND: length 66.5
  Top Layer w0.203: v2(27.25,22.7) 27.25,24.14 U6.4 ; C46.1 v2(55.4,40.78)
  Top Layer w0.254: v2(47.84,38.6) SW1.1
  Top Layer w0.305: 34.76,33.27 34.76,34.49 v2(34.52,34.73) ; U5.19 47.8,28.71 v2(46.25,28.71) ; v2(31.11,19.65) 31.69,20.22 U5.74 ; v1(50.11,24.42) v1(51.59,24.42) v1(52.04,23.97) v1(52.04,22.76) v1(52.04,21.73) v1(53.62,20.16) v1(54.56,20.16) v2(55.55,20.16) 55.55,21 C45.1 56.31,21.02 56.57,21.28 v1(56.57,21.58) v1(56.57,22.61) v1(56.57,23.43) v1(56.57,24.32) v2(56.57,25.08) ; v2(56.57,25.08) v1(56.57,25.93) 56.57,26.33 56.29,26.61 v1(55.91,26.61) v1(54.82,26.61) v1(53.55,26.61) v1(52.35,26.61) v1(51.54,25.79) v1(50.3,25.79) v1(49.2,25.79) ; v2(56.57,25.08) 56.48,25.17 X1.2 ; U5.99 45.76,17.04 v2(46.25,16.55) ; v2(46.25,24.22) 47.81,24.22
  Top Layer w0.381: v2(24,15.74) 24,16.63 C2.1 ; C6.1 15.53,16.85 v2(14,16.85) ; v2(30.45,37.27) C32.2 ; v2(19.58,33.77) 20.69,34.88 C43.1 ; C39.1 32.26,17.24 v2(31.83,16.8) ; v2(17.15,16.24) U2.2 ; v2(31.01,34.12) 31.34,33.8 31.34,33.79 ; v2(17.04,11.16) 16.99,11.22 16.99,11.7 LED1.1 ; C42.1 24.91,34.93 v2(25.07,35.09) ; v2(43.82,10.6) R8.1 ; USB1.A12 8.84,14.24 v2(8.99,14.39) 8.84,14.54 USB1.B1 ; v2(25.37,14.57) C7.1 ; USB1.B12 8.94,20.64 v2(9.07,20.76) 8.89,20.94 USB1.A1 ; v2(47.07,33.26) 47.06,33.27 46.26,33.27 ; v2(13.72,20.71) R9.2 ; R10.2 v2(13.79,15.68) ; v2(48.69,18.07) 48.69,18.05 C38.1 ; v2(53.42,30.01) 52.37,31.06 C34.1 ; C31.2 55.51,30.79 v2(55.55,30.82) ; C40.1 48.98,33.7 v2(49.4,34.12) ; v2(31.06,12.22) C33.2
  Bottom Layer w0.203: FPC1.10 v2(5.87,35.66)
  Bottom Layer w0.508: v2(2.97,37.83) 4.45,37.83 4.47,37.81 ; v2(3.07,29.05) 4.44,29.05 FPC1.12
  vias: v2(2.26,40.42) v2(2.31,26.56) v2(9.12,29.71)
VCC: length 44.1
  Top Layer w0.203: v2(56.36,29.96) 57.43,29.96 ; U5.6 48.97,22.22 v2(49,22.19) ; v2(57.12,40.98) R15.2
  Top Layer w0.254: U5.20 47.83,29.2 50.42,29.2 C34.2 51.61,30.39
  Top Layer w0.305: 45.76,33.27 45.76,34.29 46.56,35.09 47.52,35.09 C40.2 ; U5.11 49.21,24.72 v2(49.45,24.47)
  Top Layer w0.33: U5.75 32.71,19.27 C39.2 ; U5.100 47.04,18.17 48.35,16.85 ; v2(31.78,34.84) 33.34,33.27 34.26,33.27
  Top Layer w0.381: X1.4 53.38,22.08 C45.2 v2(53.72,21.02) ; U6.8 23.5,33.02 C42.2 22.94,33.48 21.06,33.48 21.01,33.43 v2(21.01,32.04) ; C39.2 31.06,17.62 v2(31.01,17.62) ; 48.09,34.53 48.28,34.53 v2(48.64,34.89) ; v2(22.83,13.6) 22.83,12.09 R14.1 ; v2(48.79,16.45) 48.39,16.85 48.35,16.85 ; C34.2 51.52,30.29 v2(52.65,29.15)
  Top Layer w0.508: CN1.1 6.38,37.21 v2(6.38,37.22)
  Bottom Layer w0.203: v2(53.72,21.02) 50.17,21.02 v2(49,22.19) ; FPC1.1 v2(6.27,31.16)
  vias: v2(20.45,16.65) v2(20.45,16.14) v2(21.01,16.65) v2(21.01,16.19) v2(21.51,16.33) v2(21.51,15.85) v2(21.98,16.3) v2(21.97,15.68) v2(22.54,15.68) v2(23.12,15.68)
VDDA: length 10.5
  Top Layer w0.254: U5.21 v2(49.56,29.72)
  Top Layer w0.381: L1.2 54.8,31.89 C31.1 52.72,31.88 v2(52.7,31.89)
  Bottom Layer w0.254: v2(52.7,31.89) 50.52,29.71 49.56,29.71 v2(49.56,29.72)
AD_CLK: length 41.7
  Top Layer w0.203: U5.52 30.42,31.22 25.12,36.51 19.69,36.51 18.01,34.84 H5.9 16.33,33.57 14.35,33.57 12.78,35.14 12.78,43.37 13.28,43.88 13.28,45.61 13.69,46.01 18.37,46.01 H4.9
AD_D0: length 45.1
  Top Layer w0.203: v2(36.7,20.1) 36.7,18.22 U5.81 36.76,10.46 33.05,6.74 33.05,5.04 H3.19
  Inner2 w0.203: v2(36.7,20.1) 36.7,18.02 34.21,15.53 28.07,15.53 24.71,18.89 22.33,18.89 17.6,23.61 H5.1
AD_D1: length 44.5
  Top Layer w0.203: H3.22 34.29,6.74 37.26,9.71 U5.82 37.26,18.17 v2(37.26,19.7)
  Inner2 w0.203: v2(37.26,19.7) 37.26,17.82 34.47,15.02 27.91,15.02 24.51,18.43 22.02,18.43 17.81,22.64 16.08,22.64 15.06,23.66 H5.2
AD_D2: length 47.8
  Top Layer w0.203: v2(37.77,20.21) 37.77,18.18 U5.83 37.76,8.92 35.53,6.69 35.53,4.99 H3.21
  Inner2 w0.203: H5.3 18.97,25.84 18.97,23 22.63,19.34 25.02,19.34 28.32,16.04 33.96,16.04 35.69,17.77 35.69,20.16 36.2,20.66 37.41,20.66 37.72,20.36
AD_D3: length 49.2
  Top Layer w0.203: 36.83,6.29 38.26,7.72 U5.84 38.28,18.19 v2(38.28,19.7)
  Inner2 w0.203: v2(38.28,19.7) 38.28,17.97 34.87,14.57 27.66,14.57 24.31,17.92 21.82,17.92 17.6,22.14 15.67,22.14 13.84,23.97 13.84,26 H5.4
AD_D4: length 42.6
  Top Layer w0.203: v2(38.79,20.21) 38.79,18.19 U5.85 38.76,7.38 38.07,6.69 38.07,4.99 36.83,3.75
  Inner2 w0.203: H5.5 18.62,29.76 23.65,24.73 29.64,24.73 31.78,22.59 33.15,22.59 34.52,21.22 38.13,21.22 38.79,20.56 v2(38.79,20.21)
AD_D5: length 53.5
  Top Layer w0.203: H3.26 39.26,6.4 U5.86 39.24,18.18 v2(39.24,19.7)
  Inner2 w0.203: H5.6 13.23,27.93 13.23,23.76 15.37,21.63 17.4,21.63 21.62,17.41 24.16,17.41 27.46,14.11 35.23,14.11 39.24,18.12 v2(39.24,19.7)
AD_D6: length 45
  Top Layer w0.203: H3.25 40.56,4.94 40.56,6.59 39.76,7.4 U5.87 39.76,20.2 v2(39.75,20.21)
  Inner2 w0.203: H5.7 17.6,31.59 23.95,25.24 29.85,25.24 31.98,23.1 33.35,23.1 34.77,21.68 38.48,21.68 39.75,20.41 v2(39.75,20.21)
AD_D7: length 58.8
  Top Layer w0.203: 41.61,6.29 41.61,6.59 40.26,7.94 U5.88 v2(40.26,19.7)
  Inner2 w0.203: H5.8 12.57,29.81 12.57,23.61 15.01,21.17 17.2,21.17 21.51,16.85 24.05,16.85 27.25,13.65 35.64,13.65 40.26,18.28 v2(40.26,19.7)
AD_OTR: length 32.9
  Top Layer w0.203: H4.7 13.49,41.16 13.49,36.41 H5.10 16.33,36.11 18.47,36.11 19.43,37.07 25.48,37.07 30.83,31.72 U5.51
ADC3: length 39.4
  Top Layer w0.35: 47.19,27.72 58.06,27.72 arc(59.19,27.25) 59.66,26.11 59.66,21.59 arc(60.35,19.94) 61.99,19.26 73.46,19.26 arc(74.77,18.72) 75.31,17.41 75.31,13.99 arc(75.3,13.96) 75.27,13.95
ADC12: length 38.7
  Top Layer w0.35: 44.26,32.66 44.26,35.71 arc(44.69,36.74) 45.72,37.17 61,37.17 arc(62.01,37.59) 62.43,38.6 62.43,38.93 arc(62.81,39.86) 63.74,40.24 67.23,40.24 arc(68.47,39.73) 68.98,38.49 68.98,38.24 arc(69.34,37.38) 70.2,37.02 75.21,37.02 ; 75.31,37.17 arc(75.31,37.17) 75.31,37.17
BOOT0: length 17
  Top Layer w0.203: U5.94 43.26,14.41 43.82,13.86 R8.2 45.08,11.56 45.08,9.79 48.08,6.79 48.08,5.19 H3.33
CC1: length 4.2
  Top Layer w0.203: USB1.A5 8.87,18.84 10.74,20.71 R9.1
CC2: length 3.5
  Top Layer w0.203: R10.1 11.06,15.84 USB1.B5
DAC1: length 41.1
  Top Layer w0.35: 75.14,25.46 66.59,25.46 arc(63.38,26.79) 62.05,30 62.05,34.54 arc(61.55,35.75) 60.33,36.26 46.48,36.26 arc(45.62,35.9) 45.26,35.04 45.26,32.66
DN: length 8
  Top Layer w0.254: USB1.A7 7.72,17.29 6.5,17.29 6.29,17.5 6.29,18.17 6.5,18.39 7.72,18.39 USB1.B7
  Top Layer w0.286: R11.1 11.21,18.41 11.11,18.31 8.65,18.31 8.62,18.34 USB1.B7
DP: length 7
  Top Layer w0.254: v2(6.78,17.87) 6.81,17.84 USB1.A6 ; v2(6.78,16.8) 7.74,16.8 USB1.B6
  Top Layer w0.286: R12.1 11.21,17.77 11.11,17.87 8.65,17.87 8.62,17.84 USB1.A6
  Bottom Layer w0.254: v2(6.78,17.87) v2(6.78,16.8)
NRST: length 29.1
  Top Layer w0.203: v2(48.08,40.07) 51.62,40.07 53.1,38.6 SW1.2 55.28,38.6 55.35,38.66 57.12,38.66 R15.1 ; v2(46.05,26.56) 46.39,26.22 U5.14
  Bottom Layer w0.203: v2(48.08,40.07) 45.95,40.07 43.76,37.88 43.76,28.84 v2(46.05,26.56)
OCS_IN: length 5.6
  Top Layer w0.305: U5.12 53.33,25.22 arc(53.36,25.2) X1.3
PA0: length 21.1
  Top Layer w0.203: U5.22 50.24,30.22 55.22,35.19 v2(55.25,35.19)
  Bottom Layer w0.203: H4.41 60.27,40.21 v2(55.25,35.19)
PA1: length 23
  Top Layer w0.203: v2(54.13,35.09) 54.13,34.94 49.91,30.72 U5.23
  Bottom Layer w0.203: H4.42 59.05,46.08 59.05,40.02 v2(54.13,35.09)
PA2: length 18.6
  Top Layer w0.203: U5.24 49.36,31.22 53.06,34.92 v2(53.06,34.99)
  Bottom Layer w0.203: H4.39 57.73,39.65 v2(53.06,34.99)
PA3: length 20.3
  Top Layer w0.203: v2(52.04,34.94) 48.82,31.72 U5.25
  Bottom Layer w0.203: v2(52.04,34.94) 56.52,39.41 56.52,46.08 H4.40
PA5: length 15.3
  Top Layer w0.203: H4.31 47.57,44.07 44.78,41.29 v2(44.78,37.78) ; 44.76,33.27 44.78,33.25 v2(44.78,31.94)
  Bottom Layer w0.203: v2(44.78,31.94) v2(44.78,37.78)
PA7: length 15.4
  Top Layer w0.203: 43.76,33.27 43.76,41.18 46.1,43.52 46.1,46.22 H4.30
PA8: length 30.2
  Top Layer w0.203: U5.67 v2(28.52,23.72)
  Bottom Layer w0.203: v2(28.52,23.72) 22.64,23.72 17.6,18.68 17.6,7.73 19.05,6.29
PA9: length 76.2
  Top Layer w0.203: v2(34.47,23.25) 32.75,23.25 U5.68 v2(29.08,23.22)
  Bottom Layer w0.203: v2(34.47,23.25) 45.49,23.25 49.45,19.29 56.41,19.29 57.88,20.76 57.88,27.72 59.36,29.2 62.15,29.2 63.02,30.06 63.02,31.56 CN5.2 ; v2(29.08,23.22) 29.07,23.2 23.09,23.2 18.72,18.83 18.72,8.9 20.36,7.26 20.36,5.05 19.05,3.75
PA10: length 80.4
  Top Layer w0.203: v2(29.64,22.72) U5.69 34.95,22.72 v2(34.98,22.7)
  Bottom Layer w0.203: v2(29.64,22.72) 29.11,22.19 23.04,22.19 19.69,18.83 19.69,8.8 21.51,6.97 21.51,6.36 H3.12 ; CN5.3 66.07,35.54 67.08,34.53 67.08,29.96 65.76,28.64 59.72,28.64 58.45,27.37 58.45,20.41 56.62,18.58 49.35,18.58 45.24,22.7 v2(34.98,22.7)
PA11: length 44.9
  Top Layer w0.254: v2(28.22,17.77) 28.22,12.33 22.83,6.95 22.83,4.99 H3.11 ; 31.18,22.22 30.13,22.22 v2(28.17,20.26)
  Top Layer w0.287: R11.2 13.36,18.39 27.36,18.39 31.18,22.22 U5.70
  Bottom Layer w0.254: v2(28.22,17.77) 28.17,17.82 v2(28.17,20.26)
PA12: length 36.8
  Top Layer w0.254: H3.14 24.13,6.9 28.88,11.65 28.88,19.3
  Top Layer w0.287: U5.71 31.3,21.72 27.54,17.95 13.36,17.95 R12.2
PA13: length 56.7
  Top Layer w0.203: v2(24.77,20.56) 23.19,22.14 14,22.14 12.73,23.41 12.73,34.07 12.09,34.71 8.66,34.71 ; H3.13 25.43,5.04 25.43,6.9 29.64,11.11 v2(29.64,18.12) 29.64,19.34 31.52,21.22 U5.72
  Bottom Layer w0.203: v2(24.77,20.56) 24.77,20.31 27.86,17.21 28.73,17.21 v2(29.64,18.12)
PA14: length 54.1
  Top Layer w0.203: U5.76 34.26,18.06 ; 34.26,18.06 34.19,18.12 v2(33.76,18.12) ; 34.26,18.06 34.26,13.93 26.67,6.34 26.67,6.29 ; v2(24.21,20) 22.68,21.53 13.64,21.53 12.12,23.05 12.12,31.89 11.79,32.21 8.66,32.21
  Bottom Layer w0.203: v2(33.76,18.12) 33.76,17.11 32.54,15.89 28.32,15.89 v2(24.21,20)
PA15: length 17.8
  Top Layer w0.203: U5.77 34.76,13.39 27.97,6.59 27.97,5.04 26.67,3.75
PB0: length 11.6
  Top Layer w0.203: H4.27 42.26,44.53 42.26,33.27
PB1: length 14.8
  Top Layer w0.203: H4.26 41.02,46.22 41.02,42.41 41.73,41.69 41.73,33.29 41.76,33.27
PB2: length 24.7
  Top Layer w0.203: v2(41.27,31.94) 41.27,33.25 41.26,33.27 ; U6.6 26.04,32.14 26.95,33.06 v2(27.56,33.06)
  Bottom Layer w0.203: v2(27.56,33.06) 28.29,33.06 arc(28.47,32.98) 28.54,32.8 28.54,32.62 arc(28.79,32.36) 29.05,32.62 29.05,32.8 arc(29.3,33.06) 29.56,32.8 29.56,32.62 arc(29.81,32.36) 30.06,32.62 30.06,32.8 arc(30.32,33.06) 30.57,32.8 30.57,32.62 arc(30.83,32.36) 31.08,32.62 31.08,32.8 arc(31.33,33.06) 31.59,32.8 31.59,32.62 arc(31.84,32.36) 32.1,32.62 32.1,32.8 arc(32.35,33.06) 32.6,32.8 32.6,32.62 arc(32.86,32.36) 33.11,32.62 33.11,32.8 arc(33.37,33.06) 33.62,32.8 33.62,32.62 arc(33.87,32.36) 34.13,32.62 34.13,32.8 arc(34.38,33.06) 34.64,32.8 34.64,32.77 arc(34.89,32.51) 35.14,32.77 35.14,32.8 arc(35.22,32.98) 35.4,33.06 40.16,33.06 v2(41.27,31.94)
PB3: length 15.8
  Top Layer w0.203: U5.89 40.76,9.5 42.96,7.29 42.96,4.8 H3.27
PB4: length 15.7
  Top Layer w0.203: U5.90 41.26,9.71 43.36,7.61 43.36,4.84 44.45,3.75
PB5: length 13
  Top Layer w0.203: 44.45,6.29 44.45,7.24 41.76,9.93 U5.91
PB6: length 39.4
  Top Layer w0.203: 46.99,3.75 45.59,5.14 45.59,6.95 42.26,10.28 U5.92 42.26,19.83 42.24,19.85 v2(42.24,19.95) ; U6.1 23.5,22.9 v2(25.37,21.02)
  Bottom Layer w0.203: v2(25.37,21.02) 41.17,21.02 v2(42.24,19.95)
PB7: length 13.6
  Top Layer w0.203: 46.99,6.29 46.99,6.39 42.76,10.62 U5.93
PB8: length 14.3
  Top Layer w0.203: H3.34 49.53,6.92 45.75,10.71 45.75,12.84 43.76,14.83 U5.95
PB9: length 17.8
  Top Layer w0.203: H3.35 51.89,3.75 50.83,4.81 50.83,6.74 46.66,10.91 46.66,12.79 44.26,15.19 U5.96
PB10: length 18.4
  Top Layer w0.203: 36.26,33.27 36.26,37.41 30.2,43.47 29.03,43.47 28.52,43.98 28.52,46.02 H4.16
PB11: length 15.8
  Top Layer w0.203: H4.15 27.25,44.09 28.43,42.91 29.85,42.91 35.76,37 35.76,33.27
PB14: length 27.6
  Top Layer w0.203: U5.53 32.71,30.72 v2(28.88,30.72)
  Bottom Layer w0.203: H4.8 17.23,47.29 18.62,45.91 20.04,45.91 20.7,45.25 20.7,44.59 22.58,42.71 22.58,34.68 26.54,30.72 v2(28.88,30.72)
PB15: length 24.4
  Top Layer w0.203: v2(30.2,30.21) 32.7,30.21 U5.54
  Bottom Layer w0.203: v2(30.2,30.21) 29.21,31.2 26.72,31.2 23.44,34.48 23.44,46.02 H4.12
PC0: length 25.6
  Top Layer w0.203: U5.15 v2(50.11,26.72)
  Bottom Layer w0.203: v2(50.11,26.72) 50.11,27.57 62.81,40.26 H4.43
PC1: length 23.6
  Top Layer w0.203: v2(45.9,37.94) 45.9,41.14 48.69,43.93 48.69,45.61 47.57,46.73 H4.32 ; U5.16 v2(46.51,27.22)
  Bottom Layer w0.203: v2(45.9,37.94) 45.9,29.55 45.44,29.1 45.44,28.28 v2(46.51,27.22)
PC3: length 26.5
  Top Layer w0.203: U5.18 49.85,28.22 v2(50.06,28.44)
  Bottom Layer w0.203: H4.44 61.49,45.98 61.49,39.87 v2(50.06,28.44)
PC4: length 12.2
  Top Layer w0.203: 43.26,33.27 43.26,41.49 45.03,43.26 H4.29
PC5: length 14.8
  Top Layer w0.203: 42.76,33.27 42.76,41.81 43.54,42.59 43.54,46.24 H4.28
PC6: length 30.7
  Top Layer w0.203: U5.63 33.68,25.72 v2(34.11,26.15)
  Bottom Layer w0.203: v2(34.11,26.15) 34.67,26.71 34.67,30.87 33.6,31.94 27.41,31.94 25.78,33.57 25.78,46.22 H4.14
PC7: length 37.2
  Top Layer w0.203: U5.64 34.25,25.22 34.92,25.9 34.92,31.03 33.76,32.19 31.37,32.19 26.04,37.53 26.04,48.2 25.37,48.86 21.19,48.86 H4.10
PC8: length 35.2
  Top Layer w0.203: U5.65 v2(31.22,24.72)
  Bottom Layer w0.203: v2(31.22,24.72) 31.21,24.73 21.62,24.73 15.32,18.43 15.32,4.94 16.51,3.75
PC9: length 30.8
  Top Layer w0.203: U5.66 v2(29.34,24.22)
  Bottom Layer w0.203: v2(29.34,24.22) 22.12,24.22 16.51,18.61 16.51,6.29
PC10: length 14.4
  Top Layer w0.203: U5.78 35.26,12.64 29.21,6.59 29.21,6.29
PC11: length 17.1
  Top Layer w0.203: 29.21,3.75 30.66,5.19 30.66,6.9 35.76,12 U5.79
PC12: length 13.7
  Top Layer w0.203: H3.20 31.75,6.59 36.26,11.1 U5.80
PC13: length 22.1
  Top Layer w0.203: U5.7 49.15,22.72 52.6,19.26 52.6,13.83 59.69,6.74 H3.42
PC14: length 26.4
  Top Layer w0.203: U5.8 49.29,23.22 53.11,19.39 53.11,14.41 61.04,6.49 61.04,4.81 62.1,3.75 62.23,3.75
PC15: length 28.9
  Top Layer w0.203: 64.77,3.75 64.64,3.75 63.47,4.92 63.47,6.9 62.97,7.4 61.39,7.4 53.62,15.18 53.62,19.49 49.4,23.72 U5.9
PD8: length 28.5
  Top Layer w0.203: v2(29.54,29.71) 32.7,29.71 U5.55
  Bottom Layer w0.203: v2(29.54,29.71) 26.85,29.71 21.72,34.84 21.72,41.24 19.69,43.27 15.42,43.27 14.55,44.14 H4.5
PD9: length 23.3
  Top Layer w0.203: v2(24.26,43.37) 23.7,43.37 22.31,44.75 H4.11 ; v2(31.42,29.2) 32.69,29.2 U5.56
  Bottom Layer w0.203: v2(31.42,29.2) 31.42,30.92 30.76,31.59 27.05,31.59 24.26,34.38 v2(24.26,43.37)
PD10: length 35.4
  Top Layer w0.203: U5.57 v2(34.01,28.72)
  Bottom Layer w0.203: H4.6 13.28,46.03 13.28,44.44 15.01,42.71 18.72,42.71 20.9,40.53 20.9,34.94 27.33,28.51 33.81,28.51 v2(34.01,28.72)
PD11: length 10.2
  Top Layer w0.152: U5.58 31.5,28.22 arc(31.32,28.29) 31.25,28.47 31.25,28.55 arc(30.99,28.8) 30.74,28.55 30.74,28.47 arc(30.49,28.22) 30.23,28.47 30.23,28.58 arc(29.98,28.84) 29.72,28.58 29.72,28.47 arc(29.47,28.22) 29.22,28.47 29.22,28.58 arc(28.96,28.84) 28.71,28.58 28.71,28.47 arc(28.63,28.29) 28.45,28.22 28.21,28.22 27.3,29.12 U6.5
PD12: length 10.3
  Top Layer w0.152: U5.59 32.7,27.72 26.85,27.72 24.77,25.64 U6.2
PD13: length 24.8
  Top Layer w0.152: v2(27.1,27.22) 27.68,27.22 arc(27.86,27.14) 27.93,26.96 27.93,26.24 arc(28.19,25.99) 28.44,26.24 28.44,26.96 arc(28.7,27.22) 28.95,26.96 28.95,26.24 arc(29.2,25.99) 29.46,26.24 29.46,26.96 arc(29.71,27.22) 29.97,26.96 29.97,26.57 arc(30.22,26.31) 30.47,26.57 30.47,26.96 arc(30.55,27.14) 30.73,27.22 32.71,27.22 ; v2(25.58,27.22) 25.19,27.22 arc(24.89,27.34) 24.77,27.64 24.77,27.67 arc(24.71,27.81) 24.57,27.86 23.54,27.86 arc(23.35,28.05) 23.54,28.24 24.57,28.24 arc(24.77,28.44) 24.57,28.63 23.53,28.63 arc(23.34,28.82) 23.53,29.01 24.57,29.01 arc(24.77,29.2) 24.57,29.39 23.53,29.39 arc(23.34,29.58) 23.53,29.77 24.57,29.77 arc(24.71,29.82) 24.77,29.96 U6.7
  Bottom Layer w0.152: v2(27.1,27.22) v2(25.58,27.22)
PD14: length 31.1
  Top Layer w0.203: U5.61 v2(31.11,26.72) ; v2(25.22,37.88) v2(20.09,37.88)
  Bottom Layer w0.203: v2(20.09,37.88) 20.09,35.01 28.38,26.72 v2(31.11,26.72) ; v2(25.22,37.88) 25.22,44.24 H4.13
PD15: length 33
  Top Layer w0.203: U5.62 32.69,26.2 v2(31.47,26.2)
  Bottom Layer w0.203: v2(31.47,26.2) 25.88,26.2 24.71,27.37 24.71,29.6 19.43,34.89 19.43,40.27 17.75,41.95 14.5,41.95 12.01,44.45 H4.3
PE0: length 14.9
  Top Layer w0.203: H3.36 52.07,6.69 47.47,11.29 47.47,12.74 44.76,15.45 U5.97
PE1: length 18.3
  Top Layer w0.203: U5.98 45.26,15.69 47.98,12.97 47.98,12.18 53.31,6.85 53.31,5.04 54.61,3.75
PE2: length 24.7
  Top Layer w0.152: v2(46.3,19.7) 47.79,19.7 U5.1 ; v2(26.75,21.63) 26.04,22.34 U6.3
  Bottom Layer w0.152: v2(46.3,19.7) 45.03,19.7 43.1,21.63 v2(26.75,21.63)
PE3: length 17.2
  Top Layer w0.203: 54.61,6.29 54.61,6.79 50.37,11.04 50.37,18.51 48.66,20.22 U5.2
PE4: length 21.5
  Top Layer w0.203: U5.3 48.86,20.72 50.88,18.7 50.88,11.87 55.85,6.9 55.85,5.32 57.15,4.03 57.15,3.75
PE5: length 19.6
  Top Layer w0.203: 57.15,6.29 57.15,6.77 51.44,12.48 51.44,18.94 49.15,21.22 U5.4
PE6: length 23.8
  Top Layer w0.203: U5.5 49.31,21.72 52.04,18.99 52.04,13.3 58.29,7.05 58.29,5.14 H3.41
PE7: length 53.7
  Top Layer w0.203: 40.76,33.27 40.75,33.27 40.75,41.71 39.95,42.52 H4.25
  Inner2 w0.203: v2(5.82,31.66) 7.32,31.66 14.71,39.05 35.99,39.05 39.95,43.01 H4.25
  Bottom Layer w0.203: FPC1.2 v2(5.82,31.66)
PE8: length 57.7
  Top Layer w0.203: H4.24 37.41,46.63 38.68,45.35 38.68,42.86 40.26,41.29 40.26,33.27
  Inner2 w0.203: v2(6.27,32.16) 7.16,32.16 14.55,39.56 35.03,39.56 38.63,43.17 38.63,46.07 H4.24
  Bottom Layer w0.203: FPC1.3 v2(6.27,32.16)
PE9: length 51.2
  Top Layer w0.203: 39.76,33.27 39.76,40.82 37.41,43.18 H4.23
  Inner2 w0.203: v2(5.82,32.66) 7,32.66 14.45,40.12 34.16,40.12 37.41,43.37 37.41,44.75 H4.23
  Bottom Layer w0.203: FPC1.4 v2(5.82,32.66)
PE10: length 55.2
  Top Layer w0.203: H4.22 36.09,46.07 36.09,43.42 39.26,40.26 39.26,33.27
  Inner2 w0.203: H4.22 34.87,47.29 36.09,46.06 36.09,43.37 33.4,40.68 14.35,40.68 6.83,33.16 v2(6.27,33.16)
  Bottom Layer w0.203: v2(6.27,33.16) 7.16,33.16 FPC1.5
PE11: length 48.8
  Top Layer w0.203: 38.76,33.27 38.76,39.95 34.87,43.84 H4.21
  Inner2 w0.203: v2(5.82,33.67) 6.68,33.67 14.2,41.19 32.54,41.19 34.87,43.51 H4.21
  Bottom Layer w0.203: v2(5.82,33.67) 7.16,33.67 FPC1.6
PE12: length 52.8
  Top Layer w0.203: 38.26,33.27 38.26,39.22 33.55,43.93 33.55,46.07 H4.20
  Inner2 w0.203: H4.20 33.66,45.96 33.66,43.78 31.57,41.69 14.09,41.69 6.56,34.16 v2(6.27,34.16)
  Bottom Layer w0.203: FPC1.7 v2(6.27,34.16)
PE13: length 46.3
  Top Layer w0.203: H4.19 32.33,44.09 37.76,38.66 37.76,33.27
  Inner2 w0.203: H4.19 32.33,43.89 30.64,42.2 13.94,42.2 6.41,34.66 v2(5.82,34.66)
  Bottom Layer w0.203: FPC1.8 v2(5.82,34.66)
PE14: length 47.8
  Top Layer w0.203: H4.18 30.91,46.17 30.91,44.44 37.26,38.09 37.26,33.27
  Inner2 w0.203: v2(6.27,35.16) 6.27,35.19 13.79,42.71 27.3,42.71 28.52,43.93 28.52,45.86 29.79,47.12 H4.18
  Bottom Layer w0.203: FPC1.9 v2(6.27,35.16)
PE15: length 14.4
  Top Layer w0.203: H4.17 36.76,37.78 36.76,33.27
PH1: length 25.2
  Top Layer w0.203: v2(46.1,25.79) 46.2,25.69 47.78,25.69 U5.13
  Bottom Layer w0.203: H4.33 49.6,44.75 43,38.16 43,28.89 v2(46.1,25.79)
VCAP1: length 8.6
  Top Layer w0.254: U5.73 33.65,20.72 34.01,20.36 34.01,19.49 33.2,18.68 33.2,16.59 C33.1
VCAP2: length 5.9
  Top Layer w0.305: 35.26,33.27 35.26,36.13 34.11,37.27 C32.1
$1N6362: length 2.4
  Top Layer w0.381: C7.2 21.3,14.57 U2.4
$1N9146: length 2.5
  Top Layer w0.381: R14.2 21.31,12.08 LED1.2

## Copper pours and planes (outline as drawn; the poured copper is in the pictures)
+5V on Top Layer: 13.26,14.5 13.1,14.5 12.55,13.95 12.55,11.29 12.88,10.96 14.76,10.96 15.06,11.27 15.06,13.04 15.52,13.5 18.16,13.5 18.92,14.26 18.92,15.55 18.67,15.8 16.8,15.8 16.4,16.2 14.64,16.2 14.2,15.76 14.2,14.72 13.34,14.72 13.13,14.52 13.24,14.52
+5V on Top Layer: 17.36,15.8 17.36,13.5 19.13,13.5 19.69,14.06 19.69,16.99 19.12,17.56 17.37,17.56 17.27,17.46 17.27,16.93 17.45,16.75 18.44,16.75 18.67,16.53 18.67,15.96 18.48,15.77 17.39,15.77
+5V on Inner2: 12.55,12.11 12.55,11.59 10.64,9.69 8.1,9.69 7.29,8.88 7.29,5.52 7.95,4.86 9.53,4.86 10.13,5.47 10.13,7.39 10.96,8.22 67.23,8.22 68.61,6.85 68.61,2.58 69.16,2.02 70.89,2.02 71.4,2.53 71.4,8.62 67.67,12.35 66.66,12.35 65.65,13.37 65.65,14.78 62.88,14.78 60.39,12.3 21.45,12.3 19.69,14.06 14.05,14.06 12.62,12.64 12.62,12.18 12.55,12.11
GND on Inner1: 0.26,50.81 79.74,50.81 79.74,0.26 0.26,0.26
VBUS on Top Layer: 8.46,20.31 8.46,19.65 6.63,19.65 5.61,18.63 5.61,16.4 6.48,15.53 8.41,15.53 8.46,15.48 8.46,14.87 7.13,14.87 5.93,13.68 5.93,12.8 6.5,12.23 8.81,12.23 9.37,12.79 9.37,14.01 9.83,14.47 11.54,14.47 12.12,13.89 12.12,11.87 10.39,10.15 5.92,10.15 3.99,12.08 3.99,13.75 3.18,14.57 3.18,19.04 4.45,20.31
VCC on Top Layer: 20.13,17.55 23.14,17.55 23.49,17.19 23.49,15.73 23.19,15.43 21.46,15.43 21.11,15.79 20.19,15.79 19.94,16.04 19.94,17.36
VCC on Inner2: 0.11,50.96 80.15,50.96 80.15,-0.31 73.55,-0.31 72.33,0.92 72.33,9.35 68.62,13.06 67.04,13.06 66.33,13.78 66.33,15.13 62.27,15.13 60.16,13.01 22.23,13.01 20.49,14.76 13.52,14.76 12.03,13.27 12.03,11.94 10.5,10.42 7.76,10.42 6.59,9.25 6.59,5.2 7.79,4.01 10.14,4.01 10.91,4.78 10.91,7.02 11.42,7.53 66.2,7.53 67.48,6.26 67.48,0.84 66.84,0.21 0.11,0.21

Small or netless copper shapes (teardrops, artwork), in the pictures only: 302 on Top Layer, 84 on Bottom Layer, 31 on Inner2

## Text on the board
Bottom Silkscreen Layer: PE7-PE14 | QUST-KX 2023
Top Silkscreen Layer: JLCJLCJLCJLC | TO SCREEN | SCR POWER | MCU POWER | GND | 5V | 3V3 | D15 | D10 | D8 | B14 | C8 | C9 | B12 | A9 | C7 | A8 | B13 | A11 | A10 | B15 | D9 | C6 | A13 | A12 | D14 | B10 | A14 | A15 | B11 | E14 | C10 | C11 | E15 | E12 | C12 | D0 | E13 | E10 | D2 | D1 | E11 | D3 | D4 | E8 | E9 | D5 | B1 | D6 | E7 | C5 | D7 | B3 | B0 | A7 | B5 | B4 | C4 | A6 | B7 | B6 | A5 | B8 | BOT | H1 | E0 | B9 | E3 | E1 | E5 | A3 | E4 | A2 | C13 | A1 | E6 | A0 | C3 | C14 | C2 | C15 | 🗲
